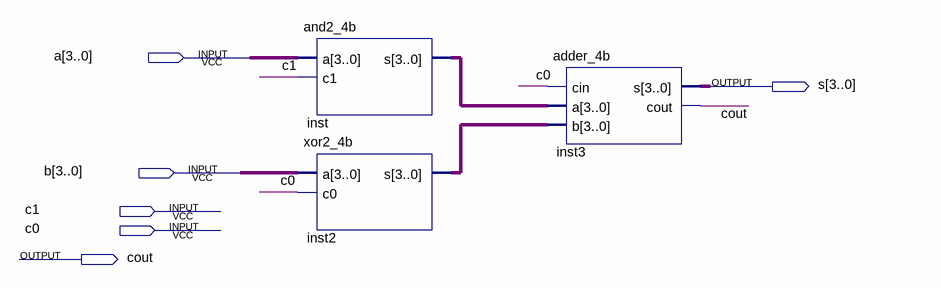
[diagram p0: schematic sheet]
// Quartus schematic blocoAritmetico.bdf as structural Verilog: 3 symbols, 6 pins
module blocoAritmetico (
  input  [3:0] a,
  input  [3:0] b,
  input  c1,
  input  c0,
  output [3:0] s,
  output cout
);

  wire [3:0] inst2_s, inst_s;

  and2_4b inst (.a(a), .c1(c1), .s(inst_s));
  xor2_4b inst2 (.a(b), .c0(c0), .s(inst2_s));
  adder_4b inst3 (.cin(c0), .a(inst_s), .b(inst2_s), .s(s), .cout(cout));
endmodule
